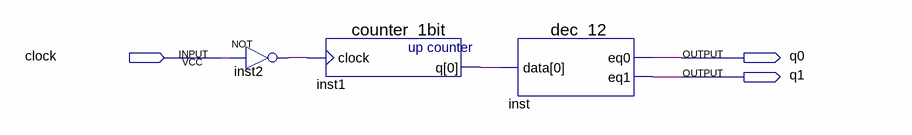
[diagram p0: schematic sheet]
// Quartus schematic sequencer2.bdf as structural Verilog: 3 symbols, 3 pins
module sequencer2 (
  input  clock,
  output q0,
  output q1
);

  wire inst1_q, inst2_out;

  not inst2 (inst2_out, clock);
  counter_1bit inst1 (.clock(inst2_out), .q(inst1_q));
  dec_12 inst (.data(inst1_q), .eq0(q0), .eq1(q1));
endmodule
